# Altium schematic sheet SD_Card.SchDoc
size A3; Organization: ETML-ES; Address1: Avenue Recordon 1; Address2: 1004 Lausanne; Address3: Switzerland; SheetNumber: 3; SheetTotal: 6
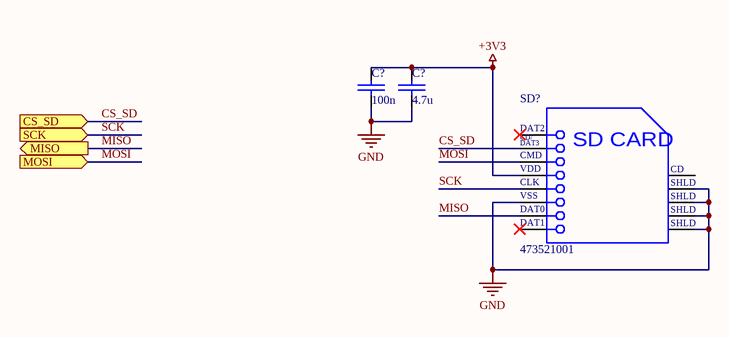
[diagram p0: SD_Card.SchDoc]

## Parts
(Parts that share a designator on the sheet are numbered #1, #2 ... from top to bottom, then left to right.)
C?#1  100n  [RC0805]
C?#2  4.7u  [RC0805]
SD?  473521001  [MOLX-473521001_V]

## Ports
CS_SD (in), MISO (out), MOSI (in), SCK (in)

## Nets
+3V3: C?#1.1 C?#2.1 SD?.4(VDD)
GND: C?#1.2 C?#2.2 SD?.6(VSS) SD?.10(SHLD) SD?.11(SHLD) SD?.12(SHLD) SD?.13(SHLD)
CS_SD: SD?.2(CD/DAT3) ; port CS_SD
MISO: SD?.7(DAT0) ; port MISO
MOSI: SD?.3(CMD) ; port MOSI
SCK: SD?.5(CLK) ; port SCK

Not connected (* = marked no-connect by the designer): SD? 1(DAT2)* 8(DAT1)* 9(CD)

## Notes on the sheet
- Fichier :
- a
- Date :
- Heure :
- Version :
- Auteur :
- Modif.
- b
- c
- d
- Projet :
- No :
- Nb feuilles
- Feuille n°
- Chemin :
- (in symbol CMP-2000-05848-1) CD/; DAT3; SD CARD

## Library data of the parts
C?#1 C?#2 = C: SDTSourceLibName: C:\WINDOWS\TEMP\DA.LIB; PCB Footprint: RC0805
SD? = CMP-2000-05848-1: MicroSD(TM), Pitch 1.1 mm, 8 Position, Height 1.88 mm, -20 to 85 degC, RoHS, Tape and Reel; Manufacturer: Molex; Datasheet Version: Rev. G, 01/2012; Datasheet URL: http://www.molex.com/pdm_docs/sd/473521001_sd.pdf; Package Reference: 473521001; Manufacturer URL: http://www.molex.com/; Mounting Technology: SurfaceMount; Package Description: MicroSD(TM), Pitch 1.1 mm, 8 Position, Height 1.88 mm